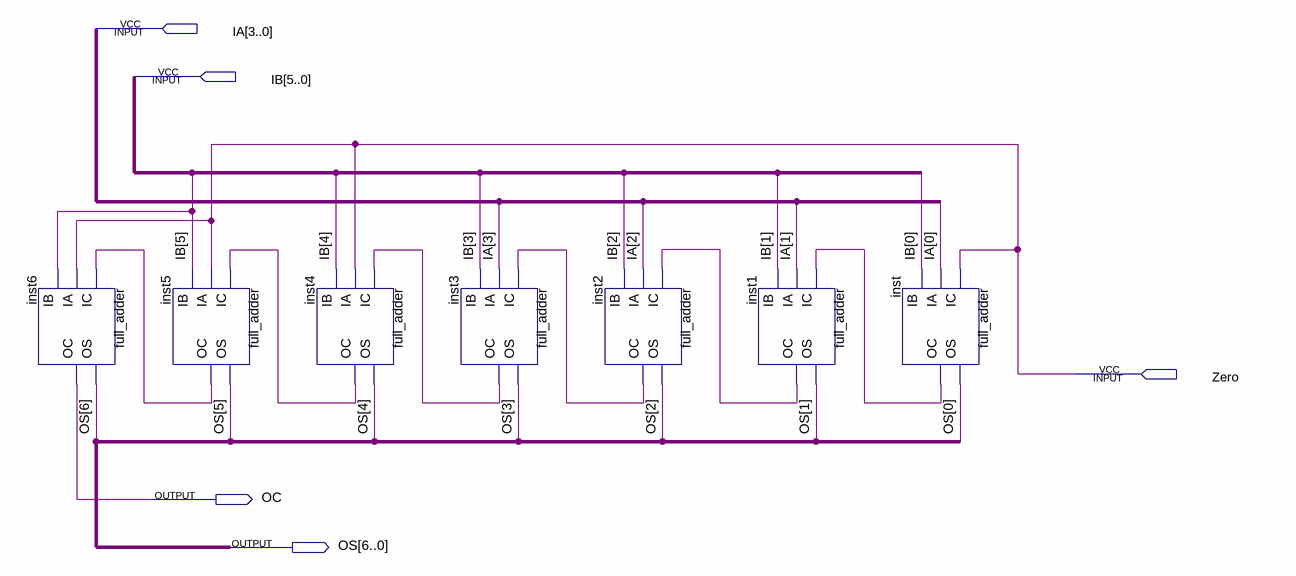
[diagram p0: schematic sheet]
// Quartus schematic time_adder.bdf as structural Verilog: 7 symbols, 5 pins
module time_adder (
  input  [3:0] IA,
  input  [5:0] IB,
  input  Zero,
  output OC,
  output [6:0] OS
);

  wire inst1_oc, inst2_oc, inst3_oc, inst4_oc, inst5_oc, inst_oc;

  full_adder inst6 (.IC(inst5_oc), .IA(Zero), .IB(IB[5]), .OS(OS[6]), .OC(OC));
  full_adder inst5 (.IC(inst4_oc), .IA(Zero), .IB(IB[5]), .OS(OS[5]), .OC(inst5_oc));
  full_adder inst4 (.IC(inst3_oc), .IA(Zero), .IB(IB[4]), .OS(OS[4]), .OC(inst4_oc));
  full_adder inst3 (.IC(inst2_oc), .IA(IA[3]), .IB(IB[3]), .OS(OS[3]), .OC(inst3_oc));
  full_adder inst2 (.IC(inst1_oc), .IA(IA[2]), .IB(IB[2]), .OS(OS[2]), .OC(inst2_oc));
  full_adder inst1 (.IC(inst_oc), .IA(IA[1]), .IB(IB[1]), .OS(OS[1]), .OC(inst1_oc));
  full_adder inst (.IC(Zero), .IA(IA[0]), .IB(IB[0]), .OS(OS[0]), .OC(inst_oc));
endmodule
